# Altium schematic sheet POWER.SchDoc: =ProjectName
size A4; CheckedBy: DatNB; Author: Ven; CompanyName: Nacentech; Organization: IMET
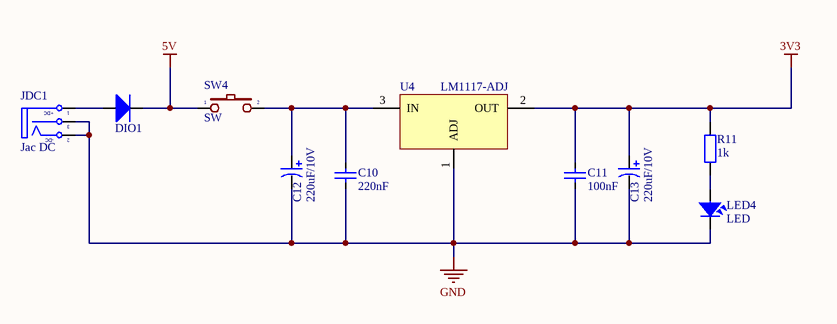
[diagram p0: POWER.SchDoc]

## Parts
C10  220nF  [CAP_0805]
C11  100nF  [CAP_0805]
C12  220uF/10V  [CAP_7343]
C13  220uF/10V  [CAP_7343]
DIO1  Diode SMD  [DIO-214AC(SMA)]  (value not drawn)
JDC1  Jac DC  [DC-IN]
LED4  LED  [LED-0805-Red]
R11  1k  [RES-SMD-0805]
SW4  SW  [SW2]
U4  LM1117-ADJ  [LM1117-SOP]

## Nets
3V3: C11.2 C13.1 R11.1 U4.2(OUT)
5V: DIO1.2(K) SW4.1
GND: C10.1 C11.1 C12.2 C13.2 JDC1.2(TN) JDC1.3(S) LED4.2 U4.1(ADJ)
NetC10_2: C10.2 C12.1 SW4.2 U4.3(IN)
NetDIO1_1: DIO1.1(A) JDC1.1(T)
NetLED4_1: LED4.1 R11.2

## Notes on the sheet
- Project:
- Page Contents:
- Size:
- Date:
- A4
- Checked by:
- Time:
- Revision:
- Sheet
- of
- File:
- (in symbol DCIN) +DC; -DC

## Library data of the parts
C10 C11 = CapSMD: Capacitor; Value: 33p; Published: 8-Jun-2000; LatestRevisionDate: 17-Jul-2002; LatestRevisionNote: Re-released for DXP Platform.; PackageReference: RAD-0.3; Publisher: Altium Limited
C12 C13 = CAP_TAN_SMD: Polazied Tantalum Capacitor
DIO1 = Diode SMD: Default Diode; Code - JEDEC: DO-214-AB; Value: 1N5007; Published: 8-Jun-2000; Revision: July-2002: Re-released for DXP Platform.; Publisher: Altium Limited
JDC1 = DCIN: Jac DC input; Value: Jac DC
LED4 = LED: LED Single colour Green and Red; Value: LED 3 ly Single Colour
R11 = Resistor - SMD: Resistor SMD; Manufacturer: Generic Components; Class: Passive; Published: 08/06/2000; Publisher: Altium Hobart Technology Centre
SW4 = SW2: Switch button 2 pin; Value: SW chip 2 pin
U4 = LM1117-ADJ: 800mA Low-Dropout Linear Regulator; Creator: Nguyen Ba Bien; Website: http://group3i.net